# Altium project Instrument_Droid.PrjPcb
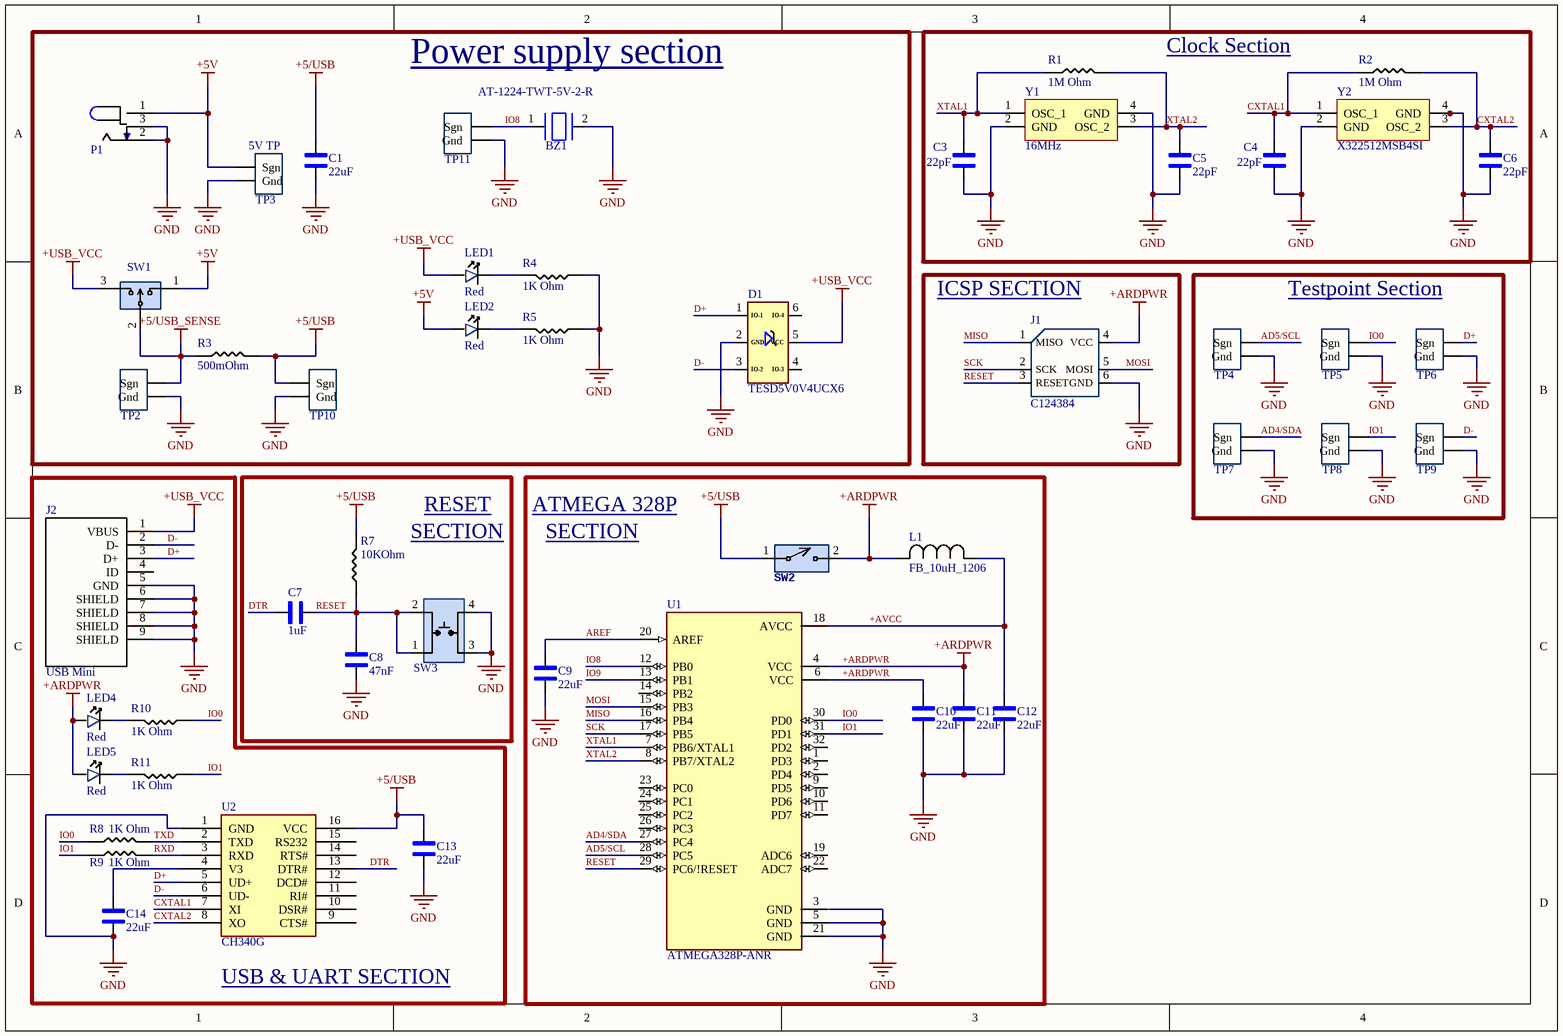
[diagram p0: Sheet1.SchDoc]
2 sheets, 87 parts. Net scope: global (net labels, ports and power ports of the same name join across sheets).
Board file: Instrument_droid.PcbDoc
Sheets:
  Sheet1.SchDoc
  Sheet2.SchDoc

## Sheet Sheet1.SchDoc
size A4; SheetNumber: 1; SheetTotal: 2

### Parts
BZ1  AT-1224-TWT-5V-2-R  [BUZZER- TH]
C1  22uF  [1206_Passive_Capacitor]
C3  22pF  [1206_Passive_Capacitor]
C4  22pF  [1206_Passive_Capacitor]
C5  22pF  [1206_Passive_Capacitor]
C6  22pF  [1206_Passive_Capacitor]
C7  1uF  [1206_Passive_Capacitor]
C8  47nF  [1206_Passive_Capacitor]
C9  22uF  [1206_Passive_Capacitor]
C10  22uF  [1206_Passive_Capacitor]
C11  22uF  [1206_Passive_Capacitor]
C12  22uF  [1206_Passive_Capacitor]
C13  22uF  [1206_Passive_Capacitor]
C14  22uF  [1206_Passive_Capacitor]
D1  TESD5V0V4UCX6  [TVS - TESD]
J1  LCSC Part#: C124384  [ICSP]  (hidden comment: NRPN032PAEN-RC)
J2  USB Mini  [USB_MINI_B]
L1  FB_10uH_1206  [AIML-1206_ABR-M]
LED1  Red  [LED_1206]
LED2  Red  [LED_1206]
LED4  Red  [LED_1206]
LED5  Red  [LED_1206]
P1  Power Jack  [Power_Jack]  (value not drawn)
R1  value 1M Ohm  [1206_Passive_Resitor]  (hidden comment: 1M)
R2  value 1M Ohm  [1206_Passive_Resitor]  (hidden comment: 1M)
R3  value 500mOhm  [1206_Passive_Resitor]  (hidden comment: 500m)
R4  value 1K Ohm  [1206_Passive_Resitor]  (hidden comment: 1k)
R5  value 1K Ohm  [1206_Passive_Resitor]  (hidden comment: 1k)
R7  value 10KOhm  [1206_Passive_Resitor]  (hidden comment: 10k)
R8  value 1K Ohm  [1206_Passive_Resitor]  (hidden comment: 1k)
R9  value 1K Ohm  [1206_Passive_Resitor]  (hidden comment: 1k)
R10  value 1K Ohm  [1206_Passive_Resitor]  (hidden comment: 1k)
R11  value 1K Ohm  [1206_Passive_Resitor]  (hidden comment: 1k)
SW1  PREC003SAAN-RC  [3_PIN_100mil]  (value not drawn)
SW2  SW_2Pin_100mil_Switch  [2Pin-Header-Conn]  (value not drawn)
SW3  TL3305AF160QG  [Switch_JLC]  (value not drawn)
TP2  10x Probe TP  [TP10x_Probe]  (value not drawn)
TP3  10x Probe TP  [TP10x_Probe]  (value not drawn)
TP4  10x Probe TP  [TP10x_Probe]  (value not drawn)
TP5  10x Probe TP  [TP10x_Probe]  (value not drawn)
TP6  10x Probe TP  [TP10x_Probe]  (value not drawn)
TP7  10x Probe TP  [TP10x_Probe]  (value not drawn)
TP8  10x Probe TP  [TP10x_Probe]  (value not drawn)
TP9  10x Probe TP  [TP10x_Probe]  (value not drawn)
TP10  10x Probe TP  [TP10x_Probe]  (value not drawn)
TP11  10x Probe TP  [TP10x_Probe]  (value not drawn)
U1  ATMEGA328P-ANR  [ATMega328P]
U2  CH340G  [USB to serial]
Y1  value 16MHz  [Crystal resonator]  (hidden comment: X322516MLB4SI)
Y2  X322512MSB4SI  [Crystal resonator]

### Blocks framed on the sheet
Power supply section: BZ1 C1 D1 LED1 LED2 P1 R3-R5 SW1 TP2 TP3 TP10 TP11
Clock Section: C3-C6 R1 R2 Y1 Y2
ICSP SECTION: J1
Testpoint Section: TP4-TP9
USB & UART SECTION: C13 C14 J2 LED4 LED5 R8-R11 U2

### Nets
+5/USB: C1.2 C13.2 R3.2 R7.2 SW2.1 TP10.1(Sgn) U2.16(VCC)
+5/USB_SENSE: R3.1 SW1.2 TP2.1(Sgn)
+5V: LED2.1 P1.1 SW1.1 TP3.1(Sgn)
+ARDPWR: C10.2 C11.2 J1.4(VCC) L1.2 LED4.1 LED5.1 SW2.2 U1.4(VCC) U1.6(VCC)
+USB_VCC: D1.5(VCC) J2.1(VBUS) LED1.1 SW1.3
GND: BZ1.2(BZ2) C1.1 C3.1 C4.1 C5.1 C6.1 C8.1 C9.1 C10.1 C11.1 C12.1 C13.1 C14.1 D1.2(GND) J1.6(GND) J2.5(GND) J2.6(SHIELD) J2.7(SHIELD) J2.8(SHIELD) J2.9(SHIELD) P1.2 P1.3 R4.1 R5.1 SW3.3 SW3.4 TP2.2(Gnd) TP3.2(Gnd) TP4.2(Gnd) TP5.2(Gnd) TP6.2(Gnd) TP7.2(Gnd) TP8.2(Gnd) TP9.2(Gnd) TP10.2(Gnd) TP11.2(Gnd) U1.5(GND) U1.21(GND) U2.1(GND) Y1.2(GND) Y1.4(GND) Y2.2(GND) Y2.4(GND)
+AVCC: C12.2 L1.1 U1.18(AVCC)
AD4/SDA: TP7.1(Sgn) U1.27(PC4)
AD5/SCL: TP4.1(Sgn) U1.28(PC5)
AREF: C9.2 U1.20(AREF)
CXTAL1: C4.2 R2.1 U2.7(XI) Y2.1(OSC_1)
CXTAL2: C6.2 R2.2 U2.8(XO) Y2.3(OSC_2)
D+: D1.1(IO-1) J2.3(D+) TP6.1(Sgn) U2.5(UD+)
D-: D1.3(IO-2) J2.2(D-) TP9.1(Sgn) U2.6(UD-)
DTR: C7.2 U2.13(DTR#)
IO0: R8.1 R10.1 TP5.1(Sgn) U1.30(PD0)
IO1: R9.1 R11.1 TP8.1(Sgn) U1.31(PD1)
IO8: BZ1.1(BZ1) TP11.1(Sgn) U1.12(PB0)
IO9: U1.13(PB1)
MISO: J1.1(MISO) U1.16(PB4)
MOSI: J1.5(MOSI) U1.15(PB3)
RESET: C7.1 C8.2 J1.3(RESET) R7.1 SW3.1 SW3.2 U1.29(PC6/!RESET)
RXD: R9.2 U2.3(RXD)
SCK: J1.2(SCK) U1.17(PB5)
TXD: R8.2 U2.2(TXD)
XTAL1: C3.2 R1.1 U1.7(PB6/XTAL1) Y1.1(OSC_1)
XTAL2: C5.2 R1.2 U1.8(PB7/XTAL2) Y1.3(OSC_2)
NetC14_2: C14.2 U2.4(V3)
NetLED1_2: LED1.2 R4.2
NetLED2_2: LED2.2 R5.2
NetLED4_2: LED4.2 R10.2
NetLED5_2: LED5.2 R11.2

Not connected (* = marked no-connect by the designer): D1 4(IO-3) 6(IO-4); J2 4(ID); U1 1(PD3) 2(PD4) 3(GND) 9(PD5) 10(PD6) 11(PD7) 14(PB2) 19(ADC6) 22(ADC7) 23(PC0) 24(PC1) 25(PC2) 26(PC3) 32(PD2); U2 9(CTS#) 10(DSR#) 11(RI#) 12(DCD#) 14(RTS#) 15(RS232)

### Notes on the sheet
- (near TP3) 5V TP
- RESET
- ATMEGA 328P
- SECTION

### Library data of the parts
BZ1 = BUZZER_1: Buzzers Transducer, Externally Driven Electromechanical/Magnetic 5 V 40mA 2.4kHz 87dB @ 5V, 10cm Through Hole PC Pins; Datasheet: https://www.puiaudio.com/media/SpecSheet/AT-1224-TWT-5V-2-R.pdf; MFR Part #: AT-1224-TWT-5V-2-R
C1 C9-C14 = C_22uF_1206: 22uF ±10% 25V X5R 1206 Multilayer Ceramic Capacitors MLCC - SMD/SMT RoHS; MFR Part #: CL31A226KAHNNNE; Type: basic; LCSC Part#: C12891; Datasheet: https://datasheet.lcsc.com/lcsc/1811031514_Samsung-Electro-Mechanics-CL31A226KAHNNNE_C12891.pdf; Value: 22uF
C3-C6 = C_22pF_1206: 22pF ±5% 1kV C0G 1206 Multilayer Ceramic Capacitors MLCC - SMD/SMT RoHS; MFR Part #: CC1206JKNPOCBN220; Type: Extended; LCSC Part#: C107174; Datasheet: https://datasheet.lcsc.com/lcsc/1810241219_YAGEO-CC1206JKNPOCBN220_C107174.pdf; Value: 22pF
C7 = C_1uF_1206: MULTILAYER CERAMIC CAPACITORS MLCC - SMD/SMT 1UF 50V 1206 ROHS; MFR Part #: CL31B105KBHNNNE; Type: Basic; Digikey Link: https://www.digikey.com/product-detail/en/C1206C105M4RACTU/399-8150-1-ND/3471873/?itemSeq=304982366; LCSC Part#: C1848; Value: 1uF
C8 = C_47nF_1206: 47nF ±5% 50V C0G 1206 Multilayer Ceramic Capacitors MLCC - SMD/SMT RoHS; MFR Part #: GRM31M5C1H473JA01L; Type: Extended; LCSC Part#: C21812; Datasheet: https://datasheet.lcsc.com/lcsc/1810201313_Murata-Electronics-GRM31M5C1H473JA01L_C21812.pdf; Value: 47nF
D1 = D_TVS_Diode_TESD: TVS SOT-23 ROHS; Value: TVS DIODE 5.5V 6TSOP; Type: Basic; MFR Part #: TESD5V0V4UCX6; LCSC Part#: C5289077; Datasheet: https://www.lcsc.com/datasheet/C5289077.pdf
J1 = J_ICSP: Connector Header Through Hole 6 position 0.079" (2.00mm); Digikey Link: https://www.digikey.com/product-detail/en/NRPN032PAEN-RC/S5801-03-ND/804955/?itemSeq=304982355; MFR Part #: NRPN032PAEN-RC; Type: Extended
J2 = J_USB_B_Mini: Through Hole USB Connectors RoHS; MFR Part #: 920-462A2021D10102; Value: USB mini B; LCSC Part#: C46398; Datasheet: https://datasheet.lcsc.com/szlcsc/2103081233_Jing-Extension-of-the-Electronic-Co-920-462A2021D10102_C46398.pdf; Type: Extended
L1 = FB_10uH_1206: 25mA 10uH ±10% 800mΩ 1206  Inductors (SMD) ROHS; Mfr_Name: FH (Guangdong Fenghua Advanced Tech); MFR PART #: CMI321609X100KT; Type: Basic; LCSC PART#: C1051; DataSheet: https://datasheet.lcsc.com/lcsc/1810311314_FH--Guangdong-Fenghua-Advanced-Tech-CMI321609X100KT_C1051.pdf
LED1 LED2 LED4 LED5 = LED_RED_1206: Red 621~631nm 1206 Light Emitting Diodes (LED) RoHS; MFR Part #: 15-21/R6C-FQ1R1B/2T; Type: Extended; LCSC Part#: C93133; Datasheet: https://datasheet.lcsc.com/szlcsc/1811151241_Everlight-Elec-15-21-R6C-FQ1R1B-2T_C93133.pdf; Value: Red
P1 = P_Power Jack: Power Barrel Connector Jack 2.10mm ID (0.083"), 5.50mm OD (0.217") Through Hole, Right Angle; MFR Part #: PJ-102A; Value: CONN PWR JACK 2X5.5MM SOLDER; Digikey Link: https://www.digikey.com/product-detail/en/PJ-102A/CP-102A-ND/275425/?itemSeq=304982367; LCSC Part#: C136744; Type: Extended
R1 R2 = R_1M_1206: CHIP RESISTOR - SURFACE MOUNT 1MOHMS ±1% 1/4W 1206 ROHS; MFR Part #: RMCF1206JT1M00; Digikey Link: https://www.digikey.com/product-detail/en/RMCF1206JT1M00/RMCF1206JT1M00CT-ND/1942830/?itemSeq=304982358; LCSC Part#: C17927; Type: Basic
R3 = R_500mOhm_1206: Resistors/Shunt 250mW 500mΩ ±800ppm/℃ ±5% 1206  Current Sense  Resistors ROHS; MFR Part #: 1206W4J050KT5E; Datasheet: https://datasheet.lcsc.com/lcsc/1810301438_UNI-ROYAL-Uniroyal-Elec-1206W4J050KT5E_C247433.pdf; LCSC Part#: C247433; Type: Extended
R4 R5 R8-R11 = R_1K_1206: CHIP RESISTOR - SURFACE MOUNT 1KOHMS ±1% 1/4W 1206 ROHS; MFR Part #: RNCP1206FTD1K00CT; Digikey Link: https://www.digikey.com/product-detail/en/RNCP1206FTD1K00/RNCP1206FTD1K00CT-ND/2240675/?itemSeq=304982373; LCSC Part#: C4410; Type: Basic
R7 = R_10KOhm_1206: 10 kOhms ±5% 0.25W, 1/4W Chip Resistor 1206 (3216 Metric) Automotive AEC-Q200 Thick Film; MFR Part #: RMCF1206FT10K0; Digikey Link: https://www.digikey.com/en/products/detail/stackpole-electronics-inc/RMCF1206FT10K0/1759669; LCSC Part#: C17902; Type: Basic
SW1 = SW_3Pin_100mil_Switch: Connector Header Through Hole 3 position 0.100" (2.54mm); Value: CONN HEADER VERT 3POS 2.54MM; Digikey Link: https://www.digikey.com/product-detail/en/PREC003SAAN-RC/S1012EC-03-ND/2774851/?itemSeq=304982371; MFR Part #: PREC003SAAN-RC; Type: Extended; LCSC Part#: C49257
SW2 = SW_2Pin_100mil_Switch: 2Pin Header; LCSC Part#: C124375; Type: Extended
SW3 = SW_Push_Button_JLC: Tactile Switch SPST-NO Top Actuated Surface Mount; MFR Part #: KH-4.5X4.5X4.3H-STM; LCSC Part#: C2837550; Type: Extended; DataSheet: https://datasheet.lcsc.com/lcsc/2106081532_Shenzhen-Kinghelm-Elec-KH-4.5X4.5X4.3H-STM_C2837550.pdf
TP2-TP11 = TP_10x_Probe: Test Point 300 mil centers
U1 = U_ATMega328P: AVR AVR® ATmega Microcontroller IC 8-Bit 20MHz 32KB (16K x 16) FLASH 32-TQFP (7x7); MFR Part #: ATMEGA328P-AU; Value: IC MCU 8BIT 32KB FLASH 32TQFP; Digikey Link: https://www.digikey.com/product-detail/en/ATMEGA328P-ANR/ATMEGA328P-ANRCT-ND/2774230/?itemSeq=304982365; LCSC Part#: C14877; Type: Basic
U2 = U_USBtoSerial: Transceiver USB 2.0 2Mbps SOP-16_150mil USB ICs RoHS; Datasheet: https://datasheet.lcsc.com/lcsc/2008191806_WCH-Jiangsu-Qin-Heng-CH340G_C14267.pdf; LCSC Part#: C14267; MFR Part #: CH340G; Type: Basic; Value: USB to Serial
Y1 = X_16Mhz_Res: ±10ppm 16000000Hz -40℃~85℃ 贴片无源晶振 60Ω 9pF SMD3225-4P Crystals ROHS; LCSC Part#: C13738; MFR Part #: X322516MLB4SI; Type: Basic
Y2 = X_12MHz_Res: SMD Crystal Resonators 12MHz ±10ppm SMD-3225_4P RoHS; LCSC Part#: C9002; MFR Part #: X322512MSB4SI; Value: 12MHz; Type: Basic; Datasheet: https://datasheet.lcsc.com/szlcsc/Yangxing-Tech-X322512MSB4SI_C9002.pdf

## Sheet Sheet2.SchDoc
size A4; SheetNumber: 2; SheetTotal: 2
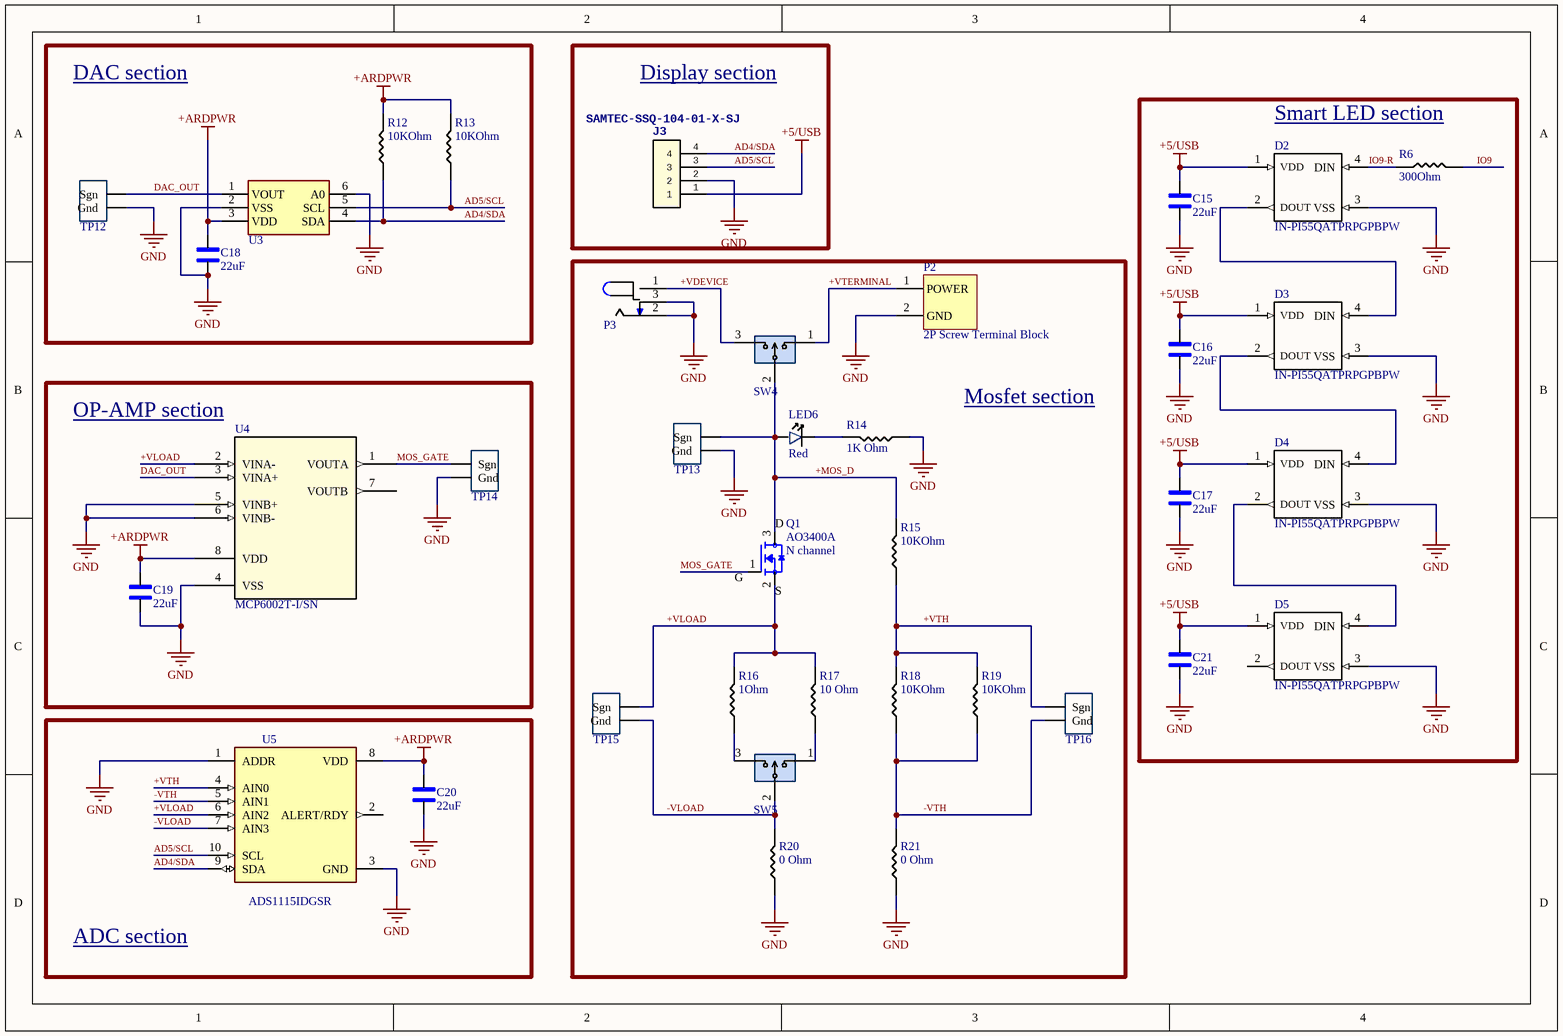
[diagram p1: Sheet2.SchDoc]

### Parts
C15  22uF  [1206_Passive_Capacitor]
C16  22uF  [1206_Passive_Capacitor]
C17  22uF  [1206_Passive_Capacitor]
C18  22uF  [1206_Passive_Capacitor]
C19  22uF  [1206_Passive_Capacitor]
C20  22uF  [1206_Passive_Capacitor]
C21  22uF  [1206_Passive_Capacitor]
D2  IN-PI55QATPRPGPBPW  [SERIAL_LED - duplicate]
D3  IN-PI55QATPRPGPBPW  [SERIAL_LED - duplicate]
D4  IN-PI55QATPRPGPBPW  [SERIAL_LED - duplicate]
D5  IN-PI55QATPRPGPBPW  [SERIAL_LED - duplicate]
J3  SAMTEC-SSQ-104-01-X-SJ  [JF-4_SSQ-104-01-X-S]
LED6  Red  [LED_1206]
P2  2P Screw Terminal Block  [P_Terminal block 3.5mm-pitch]
P3  Power Jack  [Power_Jack]  (value not drawn)
Q1  AO3400A  value N channel  [N-MOSFET]
R6  value 300Ohm  [1206_Passive_Resitor]  (hidden comment: 300 Ohm)
R12  value 10KOhm  [1206_Passive_Resitor]  (hidden comment: 10k)
R13  value 10KOhm  [1206_Passive_Resitor]  (hidden comment: 10k)
R14  value 1K Ohm  [1206_Passive_Resitor]  (hidden comment: 1k)
R15  value 10KOhm  [1206_Passive_Resitor]  (hidden comment: 10k)
R16  value 1Ohm  [1206_Passive_Resitor]  (hidden comment: 1 Ohm)
R17  10 Ohm  [1206_Passive_Resitor]
R18  value 10KOhm  [1206_Passive_Resitor]  (hidden comment: 10k)
R19  value 10KOhm  [1206_Passive_Resitor]  (hidden comment: 10k)
R20  0 Ohm  [1206_Passive_Resitor]
R21  0 Ohm  [1206_Passive_Resitor]
SW4  PREC003SAAN-RC  [3_PIN_100mil]  (value not drawn)
SW5  PREC003SAAN-RC  [3_PIN_100mil]  (value not drawn)
TP12  10x Probe TP  [TP10x_Probe]  (value not drawn)
TP13  10x Probe TP  [TP10x_Probe]  (value not drawn)
TP14  10x Probe TP  [TP10x_Probe]  (value not drawn)
TP15  10x Probe TP  [TP10x_Probe]  (value not drawn)
TP16  10x Probe TP  [TP10x_Probe]  (value not drawn)
U3  DAC IC  [MCP4725]  (value not drawn)
U4  MCP6002T-I/SN  [SOIC127P600X175-8N]
U5  ADS1115IDGSR  [ADC_ADS1115IDGSR]

### Blocks framed on the sheet
DAC section: C18 R12 R13 TP12 U3
Display section: J3
Smart LED section: C15-C17 C21 D2-D5 R6
Mosfet section: LED6 P2 P3 Q1 R14-R21 SW4 SW5 TP13 TP15 TP16
OP-AMP section: C19 TP14 U4
ADC section: C20 U5

### Nets
+5/USB: C15.2 C16.2 C17.2 C21.2 D2.1(VDD) D3.1(VDD) D4.1(VDD) D5.1(VDD) J3.1
+ARDPWR: C18.2 C19.2 C20.2 R12.2 R13.2 U3.3(VDD) U4.8(VDD) U5.8(VDD)
GND: C15.1 C16.1 C17.1 C18.1 C19.1 C20.1 C21.1 D2.3(VSS) D3.3(VSS) D4.3(VSS) D5.3(VSS) J3.2 P2.2(GND) P3.2 P3.3 R14.1 R20.1 R21.1 TP12.2(Gnd) TP13.2(Gnd) TP14.2(Gnd) U3.2(VSS) U3.6(A0) U4.4(VSS) U4.5(VINB+) U4.6(VINB-) U5.1(ADDR) U5.3(GND)
+MOS_D: LED6.1 Q1.3(D) R15.2 SW4.2 TP13.1(Sgn)
+VDEVICE: P3.1 SW4.3
+VLOAD: Q1.2(S) R16.2 R17.2 TP15.1(Sgn) U4.2(VINA-) U5.6(AIN2)
+VTERMINAL: P2.1(POWER) SW4.1
+VTH: R15.1 R18.2 R19.2 TP16.1(Sgn) U5.4(AIN0)
-VLOAD: R20.2 SW5.2 TP15.2(Gnd) U5.7(AIN3)
-VTH: R18.1 R19.1 R21.2 TP16.2(Gnd) U5.5(AIN1)
AD4/SDA: J3.4 R12.1 U3.4(SDA) U5.9(SDA)
AD5/SCL: J3.3 R13.1 U3.5(SCL) U5.10(SCL)
DAC_OUT: TP12.1(Sgn) U3.1(VOUT) U4.3(VINA+)
IO9: R6.2
IO9-R: D2.4(DIN) R6.1
MOS_GATE: Q1.1(G) TP14.1(Sgn) U4.1(VOUTA)
NetD2_2: D2.2(DOUT) D3.4(DIN)
NetD3_2: D3.2(DOUT) D4.4(DIN)
NetD4_2: D4.2(DOUT) D5.4(DIN)
NetLED6_2: LED6.2 R14.2
NetR16_1: R16.1 SW5.3
NetR17_1: R17.1 SW5.1

Not connected (* = marked no-connect by the designer): D5 2(DOUT); U4 7(VOUTB); U5 2(ALERT/RDY)

### Library data of the parts
C15-C21 = C_22uF_1206: as C1 on sheet Sheet1; LCSC Part#: C12891; Datasheet: https://datasheet.lcsc.com/lcsc/1811031514_Samsung-Electro-Mechanics-CL31A226KAHNNNE_C12891.pdf; Value: 22uF
D2-D5 = LED_Smart: LIGHT EMITTING DIODES (LED) RGB 620~630NM RED, 520~530NM GREEN, 465~475NM BLUE 600MCD@16MARED,1200MCD@16MAGREEN,300MCD@16MABLUE TOP VIEW SMD-4 ROHS; MFR Part #: XL-5050RGBC-WS2812B; Manufacturer: XINGLIGHT; LCSC Part#: C2843785; DataSheet: https://datasheet.lcsc.com/lcsc/2301111130_XINGLIGHT-XL-5050RGBC-WS2812B_C2843785.pdf
J3 = JF_4_PIN_FEMALE: 2.54mm 3A bronze -40℃~+105℃ Straight 1x4P Top 4 1 Square Holes Straight,P=2.54mm  Female Headers ROHS; MFR PART #: SSQ-104-01-X-SJ; LCSC PART#: C2718488
LED6 = LED_RED_1206: as LED1 on sheet Sheet1; LCSC Part#: C93133; Datasheet: https://datasheet.lcsc.com/szlcsc/1811151241_Everlight-Elec-15-21-R6C-FQ1R1B-2T_C93133.pdf; Value: Red
P2 = P_Terminal block: Green Straight pin 3.5mm  pitch; P=3.5mm  Screw terminal ROHS; MFR Part #: KF350-3.5-2P; Manufacturer: Cixi Kefa Elec; LCSC Part#: C474892; DataSheet: https://datasheet.lcsc.com/lcsc/2001160007_Cixi-Kefa-Elec-KF350-3-5-2P_C474892.pdf
P3 = P_Power Jack: as P1 on sheet Sheet1; Digikey Link: https://www.digikey.com/product-detail/en/PJ-102A/CP-102A-ND/275425/?itemSeq=304982367; LCSC Part#: C136744; Type: Extended
Q1 = Q_Nch_MOSFET: MOSFET N Trench 30V 5.7A 1.5V @ 250uA 26.5 m? @ 5.7A,10V SOT-23-3L RoHS; Type: Basic; LCSC Part#: C20917; Datasheet: https://datasheet.lcsc.com/szlcsc/Alpha-Omega-Semicon-AOS-AO3400A_C20917.pdf; MFR Part #: AO3400A
R6 = R_300Ohm_1206: CHIP RESISTOR - SURFACE MOUNT 300OHMS ±1% 1/4W 1206 ROHS; MFR Part #: 1206W4F3000T5E; Datasheet: https://datasheet.lcsc.com/szlcsc/Uniroyal-Elec-1206W4F3000T5E_C17887.pdf; LCSC Part#: C17887; Type: Basic
R12 R13 R15 R18 R19 = R_10KOhm_1206: as R7 on sheet Sheet1; Digikey Link: https://www.digikey.com/en/products/detail/stackpole-electronics-inc/RMCF1206FT10K0/1759669; LCSC Part#: C17902; Type: Basic
R14 = R_1K_1206: as R4 on sheet Sheet1; Digikey Link: https://www.digikey.com/product-detail/en/RNCP1206FTD1K00/RNCP1206FTD1K00CT-ND/2240675/?itemSeq=304982373; LCSC Part#: C4410; Type: Basic
R16 = R_1Ohm_1206: 1Ω ±5% 0.25W ±400ppm/℃ 1206 Chip Resistor - Surface Mount RoHS; MFR Part #: 1206W4J010JT5E; LCSC Part#: C1409; Datasheet: https://datasheet.lcsc.com/lcsc/1810301410_UNI-ROYAL-Uniroyal-Elec-1206W4J010JT5E_C1409.pdf; Type: Extended
R17 = R_10Ohm_1206: CHIP RESISTOR - SURFACE MOUNT 0.1OHMS ±1% 1/4W 1206 ROHS; MFR Part #: 1206W4F100JT5E; Datasheet: https://datasheet.lcsc.com/szlcsc/Uniroyal-Elec-1206W4F100JT5E_C17903.pdf; LCSC Part#: C17903; Type: Basic; Value: 10 Ohm
R20 R21 = R_0Ohm_1206: CHIP RESISTOR - SURFACE MOUNT 0OHMS ±1% 1/4W 1206 ROHS; MFR Part #: 1206W4F0000T5E; Datasheet: https://datasheet.lcsc.com/szlcsc/Uniroyal-Elec-1206W4F0000T5E_C17888.pdf; LCSC Part#: C17888; Type: Basic; Mouser link: https://www.mouser.com/ProductDetail/Royalohm/1206W4F0000T5E?qs=e8oIoAS2J1Thbopin%252BsagQ%3D%3D; Value: 0 Ohm
SW4 SW5 = SW_3Pin_100mil_Switch: as SW1 on sheet Sheet1; Digikey Link: https://www.digikey.com/product-detail/en/PREC003SAAN-RC/S1012EC-03-ND/2774851/?itemSeq=304982371; MFR Part #: PREC003SAAN-RC; Type: Extended; LCSC Part#: C49257
TP12-TP16 = TP_10x_Probe: Test Point 300 mil centers
U3 = U_MCP4725A0T-E/CH: IC DAC 12BIT V-OUT SOT23-6; Datasheet: https://ww1.microchip.com/downloads/en/DeviceDoc/22039d.pdf; LCSC Part#: C144198; type: Extended; MFR Part #: MCP4725A0T-E/CH
U4 = U_MCP6002T-I/SN: 0.6 V/us 2 1MHz 1.8V ~ 6V 100μA General Purpose SOIC-8_150mil  Operational Amplifier ROHS; Mfr: Microchip; MFR Part #: MCP6002T-I/SN; DataSheet: https://ww1.microchip.com/downloads/en/DeviceDoc/MCP6001-1R-1U-2-4-1-MHz-Low-Power-Op-Amp-DS20001733L.pdf; LCSC Part#: C7377; Type: Basic
U5 = U_ADC_ADS1115IDGSR: 16-Bit ADC with Integrated MUX, PGA, Comparator, Oscillator, and Reference 10-VSSOP -40 to 125; MFR Part #: ADS1115IDGSR; Package: MSOP-10 Texas Instruments; LCSC Part#: C37593; SnapEDA_Link: https://www.snapeda.com/parts/ADS1115IDGSR/Texas%20Instruments/view-part/?ref=snap; Type: Extended; DigiKey link: https://www.digikey.com/product-detail/en/texas-instruments/ADS1115IDGSR/296-38849-1-ND/5142969?utm_source=snapeda&utm_medium=aggregator&utm_campaign=symbol; Value: *

## Nets that join several sheets
+5/USB: Sheet1 (7 pins), Sheet2 (9 pins)
+ARDPWR: Sheet1 (9 pins), Sheet2 (8 pins)
GND: Sheet1 (43 pins), Sheet2 (28 pins)
AD4/SDA: Sheet1 (TP7.1 U1.27), Sheet2 (J3.4 R12.1 U3.4 U5.9)
AD5/SCL: Sheet1 (TP4.1 U1.28), Sheet2 (J3.3 R13.1 U3.5 U5.10)
IO9: Sheet1 (U1.13), Sheet2 (R6.2)